# Altium schematic sheet Inputs.SchDoc: Buttons and potentiometers
size A4; Author: Attila Sághy; DocumentNumber: 3; Revision: 11; SheetNumber: 3; SheetTotal: 3
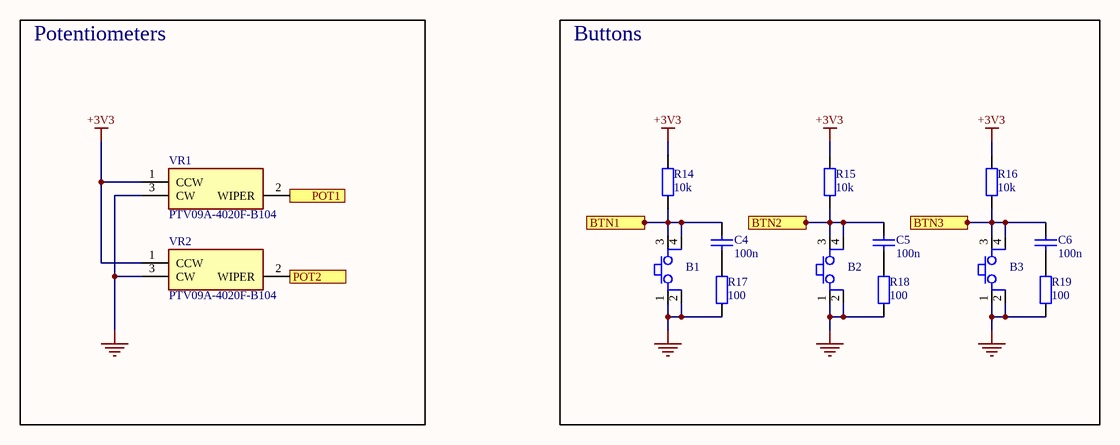
[diagram p0: Inputs.SchDoc]

## Parts
B1  FSM4JSMA  [FP_BTN_SMD]  (value not drawn)
B2  FSM4JSMA  [FP_BTN_SMD]  (value not drawn)
B3  FSM4JSMA  [FP_BTN_SMD]  (value not drawn)
C4  100n  [FP_0805_CAP_085]
C5  100n  [FP_0805_CAP_085]
C6  100n  [FP_0805_CAP_085]
R14  10k  [FP_0805_RES]
R15  10k  [FP_0805_RES]
R16  10k  [FP_0805_RES]
R17  100  [FP_0805_RES]
R18  100  [FP_0805_RES]
R19  100  [FP_0805_RES]
VR1  PTV09A-4020F-B104  [PTV09A4020FB103]
VR2  PTV09A-4020F-B104  [PTV09A4020FB103]

## Blocks framed on the sheet
Potentiometers: VR1 VR2
Buttons: B1-B3 C4-C6 R14-R19

## Ports
BTN1 (out), BTN2 (out), BTN3 (out), POT1 (out), POT2 (out)

## Nets
+3V3: R14.2 R15.2 R16.2 VR1.1(CCW) VR2.1(CCW)
GND: B1.1 B1.2 B2.1 B2.2 B3.1 B3.2 R17.1 R18.1 R19.1 VR1.3(CW) VR2.3(CW)
BTN1: B1.3 B1.4 C4.1 R14.1 ; port BTN1
BTN2: B2.3 B2.4 C5.1 R15.1 ; port BTN2
BTN3: B3.3 B3.4 C6.1 R16.1 ; port BTN3
POT1: VR1.2(WIPER) ; port POT1
POT2: VR2.2(WIPER) ; port POT2
NetC4_2: C4.2 R17.2
NetC5_2: C5.2 R18.2
NetC6_2: C6.2 R19.2

## Notes on the sheet
- Title
- Size:
- Date:
- A4
- Number:
- Time:
- Revision:
- Sheet
- of
- File:

## Library data of the parts
B1-B3 = Button 4P: Tactile Switch; Reference: 45-05-43; Supplier: Lomex; Name: Tactile Switch
C4-C6 = CAP: Capacitor; Supplier: Lomex; Reference: 82-13-46; Name: Capacitor; Value: 100n
R14-R19 = RES: Resistor; Supplier: Lomex; Name: Resistor
  R14-R16: Reference: 80-10-98; Value: 10k
  R17-R19: Reference: 80-10-74; Value: 100
VR1 VR2 = PTV09A-4020F-B104: Variable Resistor; Manufacturer_Name: Bourns; Reference: 2469525; Datasheet Link: http://www.farnell.com/datasheets/2259384.pdf; Name: PTV09A-4020F-B104; Farnell Price/Stock: https://hu.farnell.com/bourns/ptv09a-4020f-b104/pot-rotary-100kohm-9mm-20/dp/2469525; Arrow Part Number: PTV09A-4020F-B104; Arrow Price/Stock: https://www.arrow.com/en/products/ptv09a-4020f-b104/bourns?region=nac; Supplier: Farnell